# EAGLE design LED sign board 3 (EAGLE 7.2.0)
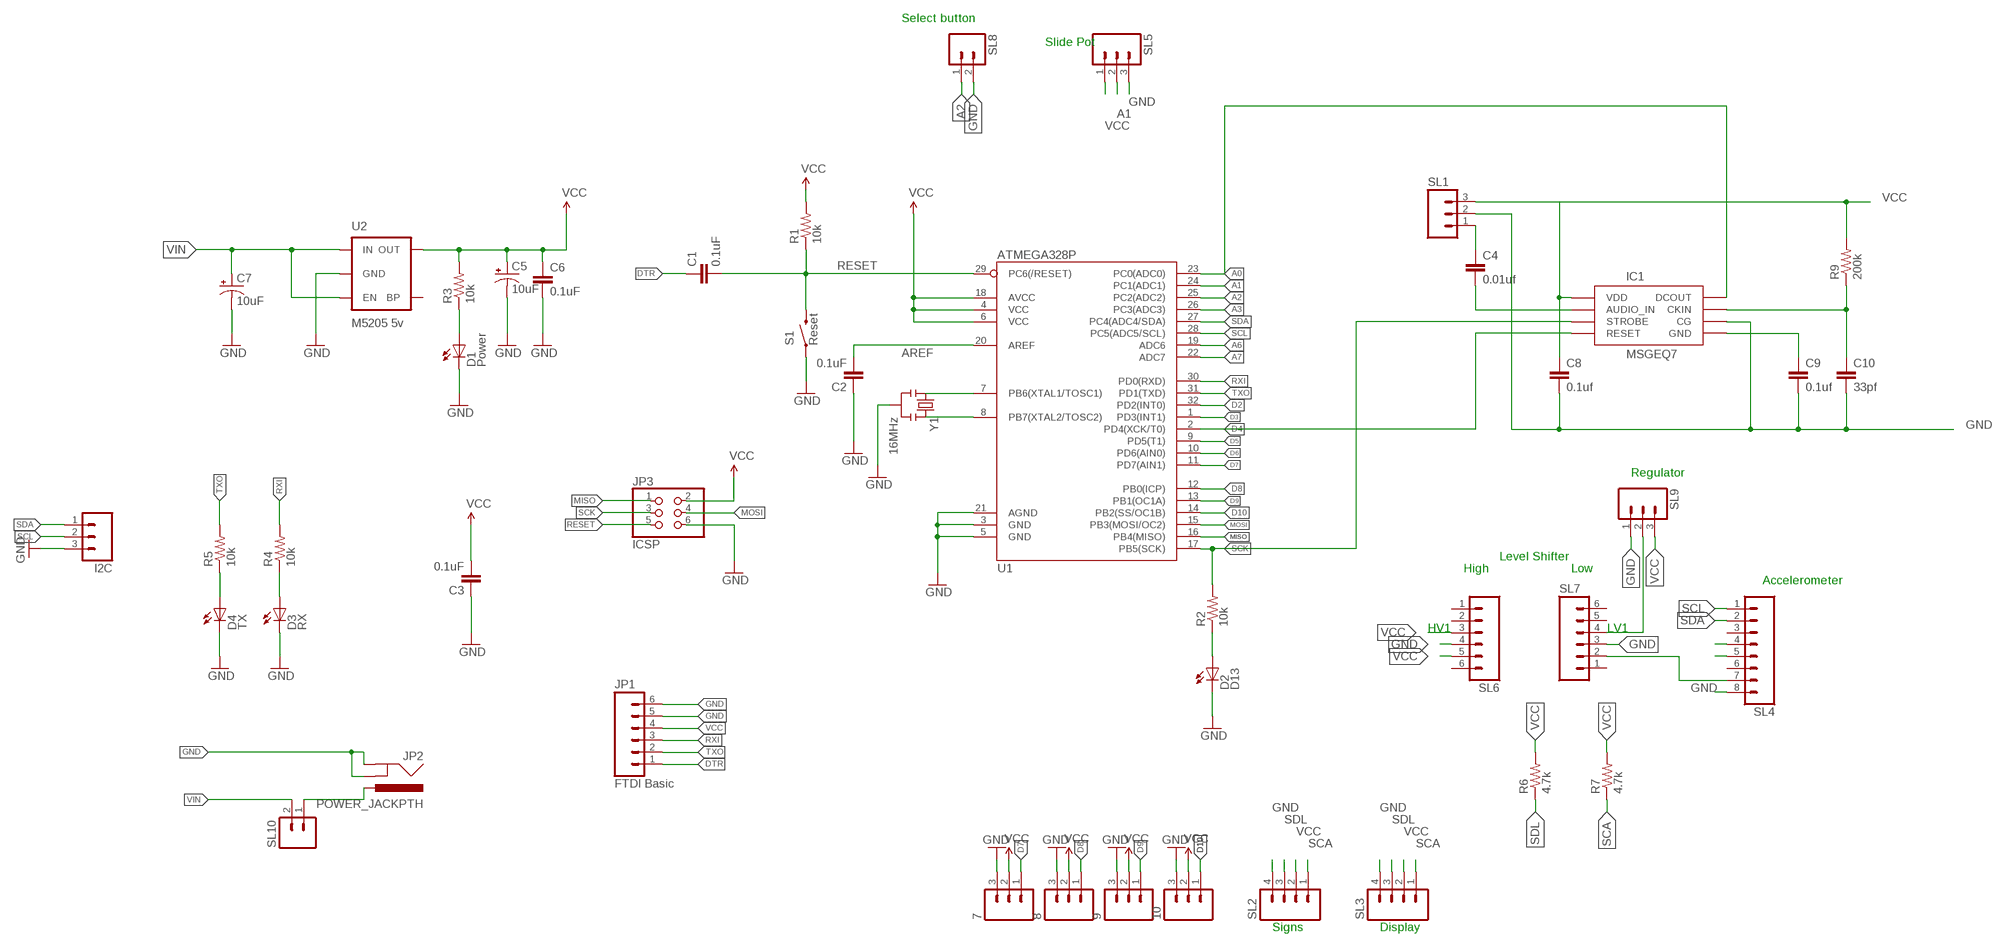
[diagram p0: schematic, sheet 1]

## Parts
7  M03PTH  [1X03]
8  M03PTH  [1X03]
9  M03PTH  [1X03]
10  M03PTH  [1X03]
C1  0.1uF  CAP0603-CAP  [0603-CAP]
C2  0.1uF  CAP0603-CAP  [0603-CAP]
C3  0.1uF  CAP0603-CAP  [0603-CAP]
C4  0.01uf  C2,5-3  [C2.5-3]
C5  10uF  CAP_POL1206  [EIA3216]
C6  0.1uF  CAP0603-CAP  [0603-CAP]
C7  10uF  CAP_POL1206  [EIA3216]
C8  0.1uf  C2,5-3  [C2.5-3]
C9  0.1uf  C2,5-3  [C2.5-3]
C10  33pf  C2,5-3  [C2.5-3]
D1  Power  LED-RED0603  [LED-0603]
D2  D13  LED-RED0603  [LED-0603]
D3  RX  LED-GREEN0603  [LED-0603]
D4  TX  LED-RED0603  [LED-0603]
I2C  M03PTH  [1X03]
IC1  MSGEQ7DIL  [DIL-08]
JP1  FTDI Basic  M06SIP  [1X06]
JP2  POWER_JACKPTH  [POWER_JACK_PTH]
JP3  ICSP  PINHD-2X3  [2X03]
R1  10k  RESISTOR0603-RES  [0603-RES]
R2  10k  RESISTOR0603-RES  [0603-RES]
R3  10k  RESISTOR0603-RES  [0603-RES]
R4  10k  RESISTOR0603-RES  [0603-RES]
R5  10k  RESISTOR0603-RES  [0603-RES]
R6  4.7k  RESISTOR1206  [1206]
R7  4.7k  RESISTOR1206  [1206]
R9  200k  RESISTOR1206  [1206]
S1  Reset  SWITCH-MOMENTARY-2SMD  [TACTILE_SWITCH_SMD]
SL1  M03  [03P]
SL2  M04  [04P]
SL3  M04  [04P]
SL4  M08  [08P]
SL5  M03  [03P]
SL6  M06  [06P]
SL7  M06  [06P]
SL8  M02  [02P]
SL9  M03  [03P]
SL10  M02  [02P]
U1  ATMEGA328P  ATMEGA328_SMT  [TQFP32-08]
U2  M5205 5v  MIC52055V  [SOT23-5]
Y1  16MHz  RESONATOR16MHZ  [RESONATOR-SMD]

## Nets
A0: IC1.3(DCOUT) U1.23(PC0(ADC0))
A1: SL5.2 U1.24(PC1(ADC1))
A2: SL8.1 U1.25(PC2(ADC2))
A3: U1.26(PC3(ADC3))
A6: U1.19(ADC6)
A7: U1.22(ADC7)
AREF: C2.2 U1.20(AREF)
D2: U1.32(PD2(INT0))
D3: U1.1(PD3(INT1))
D4: IC1.7(RESET) U1.2(PD4(XCK/T0))
D5: U1.9(PD5(T1))
D6: U1.10(PD6(AIN0))
D7: 7.1 U1.11(PD7(AIN1))
D8: 8.1 U1.12(PB0(ICP))
D9: 9.1 U1.13(PB1(OC1A))
D10: 10.1 U1.14(PB2(SS/OC1B))
DTR: C1.1 JP1.1
GND: 7.3 8.3 9.3 10.3 C2.1 C3.1 C5.C(-) C6.2 C7.C(-) C8.2 C9.2 C10.2 D1.C D2.C D3.C D4.C I2C.3 IC1.6(CG) JP1.5 JP1.6 JP2.GND JP2.GNDBREAK JP3.6 S1.1 SL1.2 SL2.4 SL3.4 SL4.8 SL5.3 SL6.4 SL7.3 SL7.4 SL8.2 SL9.1 SL9.2 U1.3(GND) U1.5(GND) U1.21(AGND) U2.2(GND) Y1.2
MISO: JP3.1 U1.16(PB4(MISO))
MOSI: JP3.4 U1.15(PB3(MOSI/OC2))
N$1: U1.7(PB6(XTAL1/TOSC1)) Y1.1
N$2: U1.8(PB7(XTAL2/TOSC2)) Y1.3
N$3: D1.A R3.1
N$4: D2.A R2.1
N$5: D3.A R4.1
N$6: D4.A R5.1
N$7: SL4.7 SL7.2
N$8: JP2.PWR SL10.1
N$9: C4.1 SL1.1
N$10: C4.2 IC1.5(AUDIO_IN)
N$11: C9.1 IC1.2(GND)
N$12: C10.1 IC1.8(CKIN) R9.1
N$14: SL4.5
N$15: SL4.4
RESET: C1.2 JP3.5 R1.1 S1.3 U1.29(PC6(/RESET))
RXI: JP1.3 R4.2 U1.30(PD0(RXD))
SCA: R7.1 SL2.1 SL3.1
SCK: IC1.4(STROBE) JP3.3 R2.2 U1.17(PB5(SCK))
SCL: I2C.2 SL4.1 U1.28(PC5(ADC5/SCL))
SDA: I2C.1 SL4.2 U1.27(PC4(ADC4/SDA))
SDL: R6.1 SL2.3 SL3.3
TXO: JP1.2 R5.2 U1.31(PD1(TXD))
VCC: 7.2 8.2 9.2 10.2 C3.2 C5.A(+) C6.1 C8.1 IC1.1(VDD) JP1.4 JP3.2 R1.2 R3.2 R6.2 R7.2 R9.2 SL1.3 SL2.2 SL3.2 SL5.1 SL6.3 SL6.5 SL9.3 U1.4(VCC) U1.6(VCC) U1.18(AVCC) U2.5(OUT)
VIN: C7.A(+) SL10.2 U2.1(IN) U2.3(EN)
Unconnected: SL4.3 SL4.6 SL6.1 SL6.2 SL6.6 SL7.1 SL7.5 SL7.6 U2.4(BP)

## Notes on the sheet
- Select button
- Slide Pot
- Regulator
- Level Shifter
- High | Low
- Accelerometer
- HV1 | LV1
- Signs | Display

## Library data of the parts
7-10 I2C = SparkFun-Connectors:M03: Header 3 Standard 3-pin 0.1" header. Use with straight break away headers (SKU : PRT-00116), right angle break away headers (PRT-00553), swiss pins (PRT-00743), machine pins (PRT-00117), and female headers (PRT-00115). Molex polarized connector foot print use with SKU : PRT-08232 with associated crimp pins and housings.
C1-C3 C6 = SparkFun-Passives:CAP: Capacitor Standard 0603 ceramic capacitor, and 0.1" leaded capacitor.
C4 C8-C10 = capacitor-wima:C: CAPACITOR naming: grid - package width
C5 C7 = SparkFun-Passives:CAP_POL: Capacitor Polarized These are standard SMD and PTH capacitors. Normally 10uF, 47uF, and 100uF in electrolytic and tantalum varieties. Always verify the external diameter of the through hole cap, it varies with capacity, voltage, and manufacturer. The EIA devices should be standard.
D1 D2 D4 = SparkFun-LED:LED-RED: Assorted Red LEDs LilyPad 1206- DIO-09912 1206- DIO-00809 0603- DIO-00819; PROD_ID: DIO-00819; VALUE: RED
D3 = SparkFun-LED:LED-GREEN: Various green LEDs Green LEDs used in SFE Production 0603- DIO-00821 LARGE- DIO-00862 LILYPAD- DIO-09910; PROD_ID: DIO-00821; VALUE: GREEN
IC1 = SparkFun-AnalogIC:MSGEQ7: 7-band graphic equalizer
JP1 = SparkFun-Connectors:M06: Header 6 Standard 6-pin 0.1" header. Use with straight break away headers (SKU : PRT-00116), right angle break away headers (PRT-00553), swiss pins (PRT-00743), machine pins (PRT-00117), and female headers (PRT-00115). Molex polarized connector foot print use with SKU : PRT-08094 with associated crimp pins and housings. NOTES ON THE VARIANTS LOCK and LOCK_LONGPADS... This footprint was designed to help hold the alignment of a through-hole component (i.e. 6-pin header) while soldering it into place. You may notice that each hole has been shifted either up or down by 0.005 of an inch from it's more standard position (which is a perfectly straight line). This slight alteration caused the pins (the squares in the middle) to touch the edges of the holes. Because they are alternating, it causes a "brace" to hold the component in place. 0.005 has proven to be the perfect amount of "off-center" position when using our standard breakaway headers. Although looks a little odd when you look at the bare footprint, once you have a header in there, the alteration is very hard to notice. Also,if you push a header all the way into place, it is covered up entirely on the bottom side. This idea of altering the position of holes to aid alignment will be further integrated into the Sparkfun Library for other footprints. It can help hold any component with 3 or more connection pins.
JP2 = SparkFun-Connectors:POWER_JACK: Power Jack This is the standard 5.5mm barrel jack for power. The PTH is the most common, proven, reliable, footprint. The Slot footprint only works if the mill layer is transmitted to the PCB fab house so be warned. Mating wall wart : TOL-00298 (and others); PROD_ID: CONN-08197
JP3 = SparkFun-Connectors:PINHD-2X3: PIN HEADER
R1-R5 = SparkFun-Passives:RESISTOR: Resistor Basic schematic elements and footprints for 0603, 1206, and PTH resistors.
R6 R7 R9 = SparkFun-Resistors:RESISTOR: Resistor Basic schematic elements and footprints for 0603, 1206, and PTH resistors.
S1 = SparkFun-Electromechanical:SWITCH-MOMENTARY-2: Various NO switches- pushbuttons, reed, etc; PROD_ID: SWCH-08247
SL1 SL5 SL9 = con-amp-quick:M03: AMP QUICK CONNECTOR; OC_FARNELL: unknown; OC_NEWARK: unknown
SL2 SL3 = con-amp-quick:M04: AMP QUICK CONNECTOR; OC_FARNELL: unknown; OC_NEWARK: unknown
SL4 = con-amp-quick:M08: AMP QUICK CONNECTOR; OC_FARNELL: unknown; OC_NEWARK: unknown
SL6 SL7 = con-amp-quick:M06: AMP QUICK CONNECTOR; OC_FARNELL: unknown; OC_NEWARK: unknown
SL8 SL10 = con-amp-quick:M02: AMP QUICK CONNECTOR; OC_FARNELL: unknown; OC_NEWARK: unknown
U1 = SparkFun-DigitalIC:ATMEGA328_SMT: 32-Pin Atmega328 part Commonly used on Arduino compatible boards Available in QFP and QFN packages TQFP is IC-09069 QFN is non-stock; PROD_ID: IC-09069
U2 = SparkFun-PowerIC:MIC5205: MIC5205 150mA vreg 3.3V - VREG-00822 5V - VREG-00823; PROD_ID: VREG-00823
Y1 = SparkFun-FreqCtrl:RESONATOR: Resonator Small SMD resonator. Used, eg, on the Arduino Pro/ Pro Mini boards. 8MHz- XTAL-08895 16MHz- XTAL-08900; PROD_ID: XTAL-08900

## Board
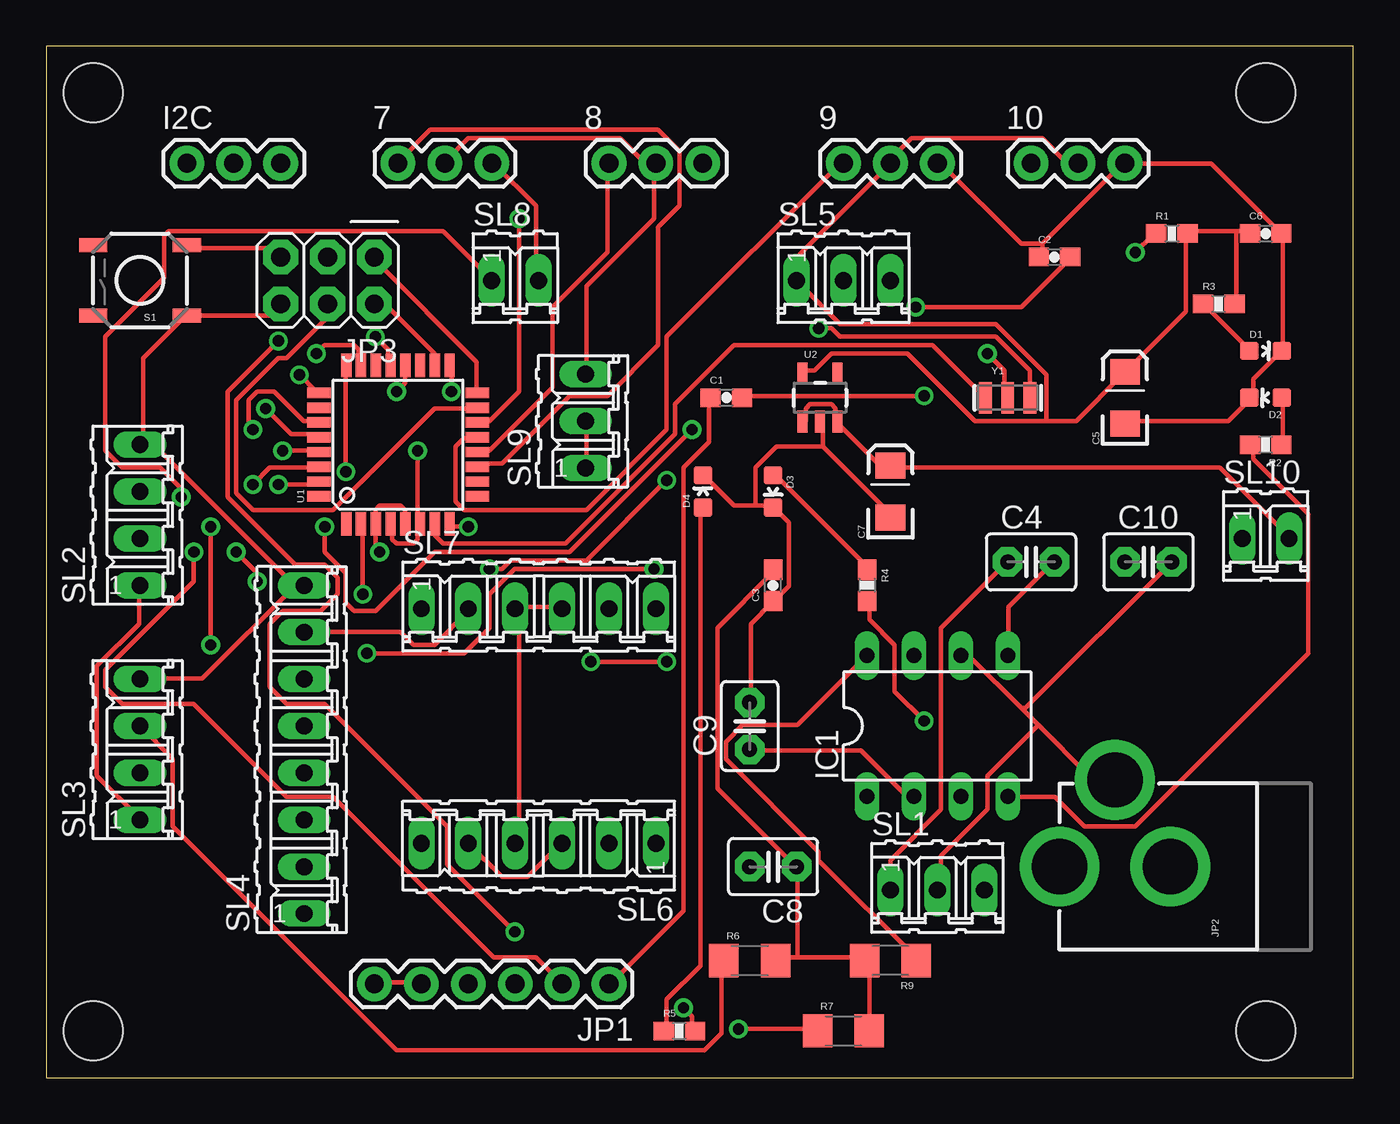
[diagram p1: board, top side]
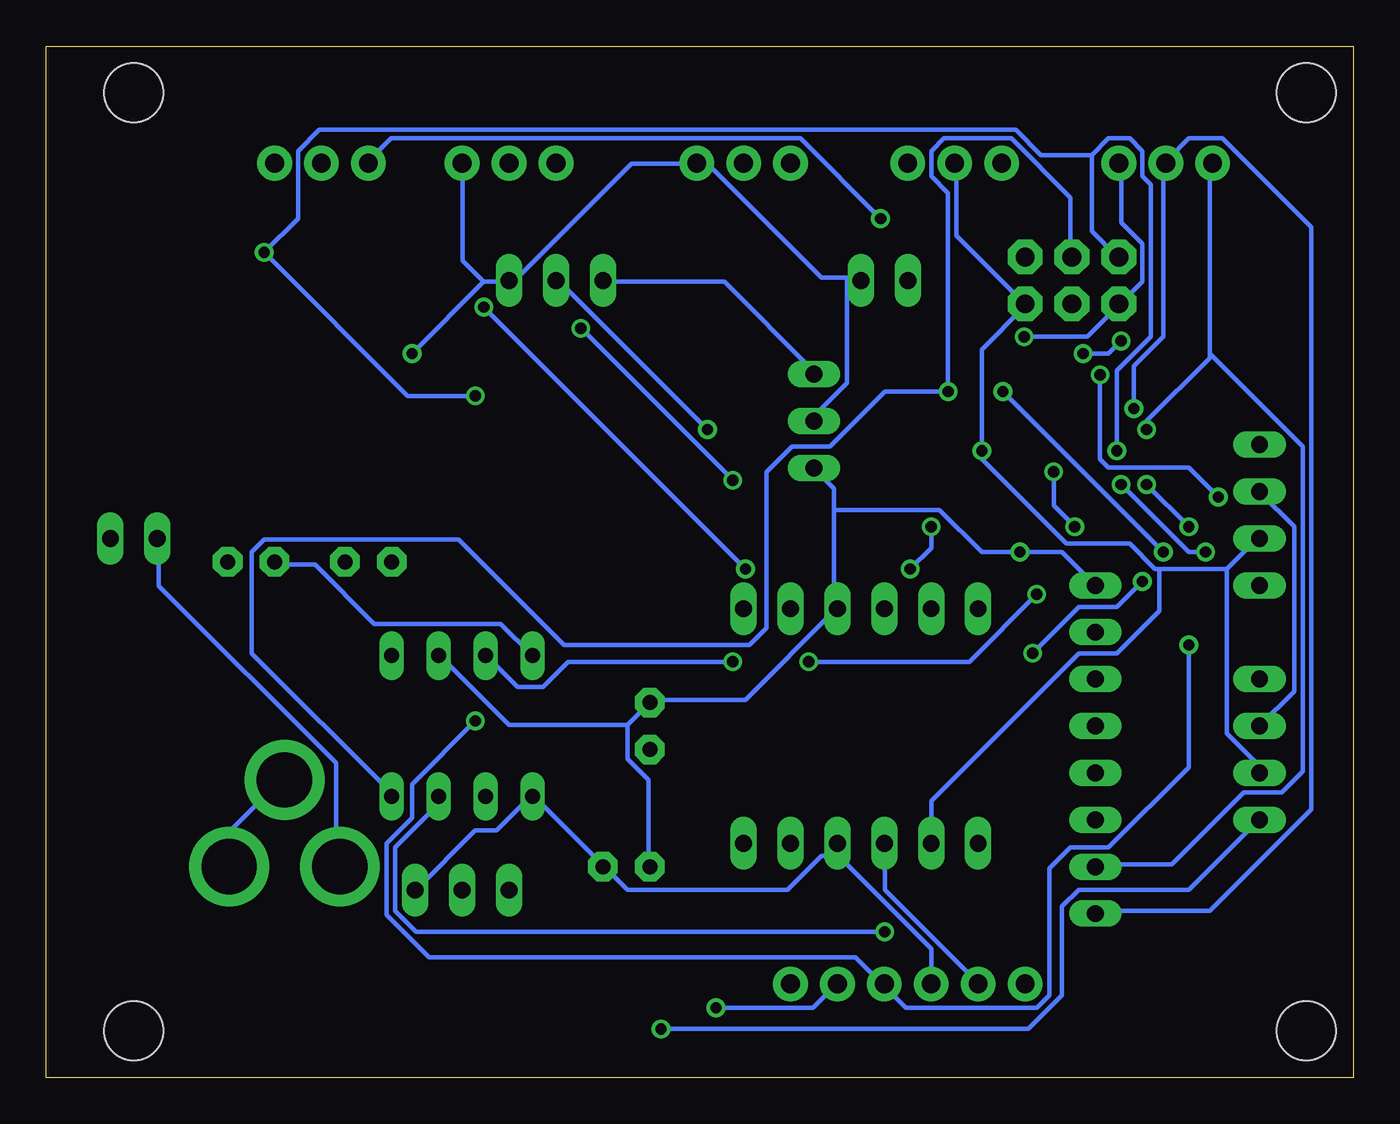
[diagram p2: board, bottom side, seen from below]

Size 70.79 x 55.87 mm. Coordinates in mm from the lower left corner, seen from the top.
Outline: 0,0 70.79,0 70.79,55.87 0,55.87 0,0
Copper layers (1*16): Top 0.035mm / dielectric 1.5mm / Bottom 0.035mm
Design rules "default": minimum track width 10mil, minimum drill 24mil, track to track 8mil, track to pad 8mil, pad to pad 8mil, via to via 8mil, smd to smd 8mil, copper to edge 40mil, drill to drill 8mil, minimum pad ring 10mil, minimum via ring 8mil, stop-mask expansion 4mil, vias tented up to drill 0mil, thermal gap 10mil
Holes 3.2 mm at 2.54,2.54 66.04,2.54 2.54,53.34 66.04,53.34

### Footprints (pad centres in the part's own frame; a part is rotated, then mirrored left to right if it is on the bottom)
1X03 = drill 1.016 pad 1.88: 1 0,0; 2 2.54,0; 3 5.08,0
0603-CAP = smd 1.1 x 1: 1 -0.85,0; 2 0.85,0
C2.5-3 = drill 0.813 pad 1.6 octagon: 1 -1.27,0; 2 1.27,0
EIA3216 = smd 1.4 x 1.6: A 1.4,0; C -1.4,0
LED-0603 = smd 1 x 1: A 0,-0.877; C 0,0.877
DIL-08 = drill 0.813 long: 1 -3.81,-3.81; 2 -1.27,-3.81; 3 1.27,-3.81; 4 3.81,-3.81; 5 3.81,3.81; 6 1.27,3.81; 7 -1.27,3.81; 8 -3.81,3.81
1X06 = drill 1.016 pad 1.88: 1 0,0; 2 2.54,0; 3 5.08,0; 4 7.62,0; 5 10.16,0; 6 12.7,0
POWER_JACK_PTH = drill 2.997 pad 4.318: GND 0,7.7; GNDBREAK 4.7,10.7; PWR 0,13.7
2X03 = drill 1.016 pad 1.88 octagon: 1 -2.54,-1.27; 2 -2.54,1.27; 3 0,-1.27; 4 0,1.27; 5 2.54,-1.27; 6 2.54,1.27
0603-RES = smd 1.1 x 1: 1 -0.85,0; 2 0.85,0
1206 = smd 1.6 x 1.8: 1 -1.4,0; 2 1.4,0
TACTILE_SWITCH_SMD = smd 1.524 x 0.762: 1 -2.54,1.905; 2 2.54,1.905; 3 -2.54,-1.905; 4 2.54,-1.905
03P = drill 0.914 long: 1 -2.54,0; 2 0,0; 3 2.54,0
04P = drill 0.914 long: 1 -3.81,0; 2 -1.27,0; 3 1.27,0; 4 3.81,0
08P = drill 0.914 long: 1 -8.89,0; 2 -6.35,0; 3 -3.81,0; 4 -1.27,0; 5 1.27,0; 6 3.81,0; 7 6.35,0; 8 8.89,0
06P = drill 0.914 long: 1 -6.35,0; 2 -3.81,0; 3 -1.27,0; 4 1.27,0; 5 3.81,0; 6 6.35,0
02P = drill 0.914 long: 1 -1.27,0; 2 1.27,0
TQFP32-08 = smd 1.27 x 0.559: 1 -4.293,2.8; 2 -4.293,2; 3 -4.293,1.2; 4 -4.293,0.4; 5 -4.293,-0.4; 6 -4.293,-1.2; 7 -4.293,-2; 8 -4.293,-2.8; 17 4.293,-2.8; 18 4.293,-2; 19 4.293,-1.2; 20 4.293,-0.4; 21 4.293,0.4; 22 4.293,1.2; 23 4.293,2; 24 4.293,2.8 | smd 0.559 x 1.27: 9 -2.8,-4.293; 10 -2,-4.293; 11 -1.2,-4.293; 12 -0.4,-4.293; 13 0.4,-4.293; 14 1.2,-4.293; 15 2,-4.293; 16 2.8,-4.293; 25 2.8,4.293; 26 2,4.293; 27 1.2,4.293; 28 0.4,4.293; 29 -0.4,4.293; 30 -1.2,4.293; 31 -2,4.293; 32 -2.8,4.293
SOT23-5 = smd 0.55 x 1.2: 1 -0.95,-1.3; 2 0,-1.3; 3 0.95,-1.3; 4 0.95,1.3; 5 -0.95,1.3
RESONATOR-SMD = smd 0.7 x 1.7: 1 -1.2,0; 2 0,0; 3 1.2,0

### Placement (x,y rotation side)
7  19.05,49.53 0 top
8  30.48,49.53 0 top
9  43.18,49.53 0 top
10  53.34,49.53 0 top
C1  36.83,36.83 0 top
C2  54.61,44.45 0 top
C3  39.37,26.67 90 top
C4  53.34,27.94 0 top
C5  58.42,36.83 90 top
C6  66.04,45.72 0 top
C7  45.72,31.75 90 top
C8  39.37,11.43 180 top
C9  38.1,19.05 90 top
C10  59.69,27.94 0 top
D1  66.04,39.37 270 top
D2  66.04,36.83 90 top
D3  39.37,31.75 180 top
D4  35.56,31.75 0 top
I2C  7.62,49.53 0 top
IC1  48.26,19.05 0 top
JP1  30.48,5.08 180 top
JP2  68.58,11.43 90 top
JP3  15.24,43.18 180 top
R1  60.96,45.72 0 top
R2  66.04,34.29 180 top
R3  63.5,41.91 0 top
R4  44.45,26.67 270 top
R5  34.29,2.54 0 top
R6  38.1,6.35 0 top
R7  43.18,2.54 0 top
R9  45.72,6.35 180 top
S1  5.08,43.18 180 top
SL1  48.26,10.16 0 top
SL2  5.08,30.48 90 top
SL3  5.08,17.78 90 top
SL4  13.97,17.78 90 top
SL5  43.18,43.18 0 top
SL6  26.67,12.7 180 top
SL7  26.67,25.4 0 top
SL8  25.4,43.18 0 top
SL9  29.21,35.56 90 top
SL10  66.04,29.21 0 top
U1  19.05,34.29 90 top
U2  41.91,36.83 0 top
Y1  52.07,36.83 0 top

### Tracks (layer width: path | path; a pad name or v marks a point on that pad's centre or on a via)
A0  (via drill 0.61)
  Top 0.254: v14.63,39.22 15.09,39.68 16.69,39.68 16.92,39.45 16.92,38.76 U1.23 | v12.57,39.9 9.83,37.16 9.83,31.45 13.49,27.79 15.09,27.79 15.77,27.1 15.77,26.19 14.86,25.27 12.8,25.27 12.12,24.59 12.12,21.16 13.03,20.24 15.09,20.24 21.72,13.61 21.72,11.56 v25.38,7.9
  Bottom 0.254: v14.63,39.22 13.26,39.22 v12.57,39.9 | v25.38,7.9 50.75,7.9 51.89,9.04 51.89,12.47 49.61,14.76 49.61,15.21 IC1.3
A1  (via drill 0.61)
  Top 0.254: v16.23,32.82 16.23,38.53 U1.24 | v15.09,29.84 15.09,28.47 16.23,27.33 16.23,25.73 16.69,25.27 17.83,25.27 21.03,28.47 28.35,28.47 v34.98,35.1
  Bottom 0.254: v16.23,32.82 16.23,30.99 v15.09,29.84 | v34.98,35.1 42.98,43.1 SL5.2
A2  (via drill 0.61)
  Top 0.254: v13.72,38.08 14.63,37.16 U1.25 | v7.32,31.45 7.32,31.9 6.17,33.05 4.12,33.05 3.2,33.96 3.2,40.13 6.4,43.33 6.4,45.62 6.63,45.85 21.49,45.85 24,43.33 SL8.1
  Bottom 0.254: v13.72,38.08 13.72,33.5 13.26,33.05 8.91,33.05 v7.32,31.45
AREF  (via drill 0.61)
  Top 0.254: v47.09,41.73 52.81,41.73 55.32,44.25 C2.2 | v32.92,27.56 25.38,27.56 24,26.19 24,24.36 22.63,22.99 v17.37,22.99 | v11.43,26.87 11.43,27.33 v10.29,28.47 | v18.97,37.16 19.43,37.62 19.43,38.53 U1.20
  Bottom 0.254: v32.92,27.56 v47.09,41.73 | v17.37,22.99 14.86,25.5 12.8,25.5 v11.43,26.87 | v18.97,37.16 v10.29,28.47
D4  (via drill 0.61)
  Top 0.254: v17.14,26.19 17.14,29.84 U1.2 | v33.6,22.53 v29.49,22.53
  Bottom 0.254: v17.14,26.19 20.8,22.53 v29.49,22.53 | v33.6,22.53 42.52,22.53 43.89,21.16 45.26,21.16 46.86,22.76 IC1.7
D7
  Top 0.254: U1.11 23.55,33.27 24.69,33.27 28.35,36.93 30.4,36.93 33.15,39.68 33.15,46.08 34.29,47.22 34.29,50.19 33.15,51.33 20.8,51.33 19.2,49.73 7.1
D8
  Top 0.254: U1.12 23.55,33.96 24,33.96 27.43,37.39 27.43,41.73 30.4,44.7 30.4,49.51 8.1
D9
  Top 0.254: U1.13 23.32,34.65 22.63,34.65 22.17,34.19 22.17,31.22 22.63,30.76 29.26,30.76 33.6,35.1 33.6,40.13 42.98,49.51 9.1
D10  (via drill 0.61)
  Top 0.254: v25.6,46.53 25.6,37.16 24,35.56 23.55,35.56 U1.14
  Bottom 0.254: v25.6,46.53 29.95,50.88 52.12,50.88 53.26,49.73 10.1
DTR
  Top 0.254: C1.1 35.89,36.7 35.89,34.42 34.52,33.05 34.52,9.04 30.63,5.16 JP1.1
GND  (via drill 0.61)
  Top 0.254: 42.06,34.19 42.06,35.33 U2.2 | 42.06,34.19 45.72,30.53 C7.C | 38.41,30.99 37.26,30.99 35.66,32.59 D4.C | 38.41,30.99 39.32,30.99 D3.C 39.55,30.76 40.23,30.07 40.23,26.64 39.55,25.96 C3.1 39.32,25.73 38.18,24.59 38.18,20.47 C9.2 | 42.06,34.19 39.55,34.19 38.41,33.05 38.41,30.99 | 53.72,19.1 56.46,16.36 57.84,16.36 JP2.GNDBREAK | 53.72,19.1 52.81,20.02 | 52.81,20.02 50.06,22.76 49.61,22.76 IC1.6 | 53.72,19.1 50.98,16.36 50.98,14.53 48.46,12.01 48.46,10.18 SL1.2 | C10.2 53.03,20.02 52.81,20.02 | C5.C 58.52,35.56 64.01,35.56 65.15,36.7 D2.C 65.38,36.93 65.38,37.85 66.75,39.22 D1.C 66.98,39.45 66.98,45.62 C6.2 66.75,45.85 63.09,49.51 58.52,49.51 10.3 58.29,49.51 53.95,45.16 | 53.95,45.16 53.95,44.48 C2.1 | v50.98,39.22 51.89,38.3 51.89,36.93 Y1.2 | 53.95,45.16 52.81,45.16 48.46,49.51 9.3 | v17.83,40.13 18.52,39.45 18.52,38.76 U1.21 | JP3.6 12.57,41.73 12.12,41.28 S1.1 7.54,41.28 5.26,38.99 5.26,34.42 SL2.4 5.26,34.19 5.94,34.19 13.49,26.64 | U1.5 19.43,30.07 19.43,30.76 19.2,30.99 18.06,30.99 17.83,30.76 17.83,30.07 U1.3 17.83,29.84 17.83,28.7 v18.06,28.47 | 13.49,26.64 8.46,21.61 5.26,21.61 SL3.4 | 13.49,26.64 13.95,26.64 SL4.8 13.49,26.64 | JP1.6 17.83,5.16 20.12,5.16 JP1.5 | SL7.4 27.89,25.5 25.6,25.5 SL7.3 25.6,25.27 25.6,12.7 SL6.4 | SL9.1 29.26,33.05 29.26,35.56 SL9.2 | SL8.2 26.52,43.33 26.52,47.22 24.23,49.51 7.3
  Bottom 0.254: 39.32,19.1 39.32,17.27 38.18,16.13 38.18,11.56 C8.2 | 39.32,19.1 C9.2 37.95,20.47 32.92,20.47 28.12,25.27 SL7.4 28.12,25.5 28.12,30.76 | JP2.GND 60.81,11.56 60.81,13.39 58.06,16.13 JP2.GNDBREAK | 39.32,19.1 45.72,19.1 49.38,22.76 IC1.6 | 47.09,43.1 v50.98,39.22 | 47.09,43.1 45.72,43.1 SL5.3 45.72,43.33 45.26,43.33 39.09,49.51 35.66,49.51 8.3 35.43,49.51 34.98,49.51 28.8,43.33 27.43,43.33 | 47.09,43.1 48.23,44.25 48.23,49.51 9.3 | v17.83,40.13 14.4,40.13 12.8,41.73 JP3.6 12.57,41.96 11.43,43.1 11.43,45.16 12.57,46.3 12.57,49.51 I2C.3 | SL4.8 15.77,28.47 v18.06,28.47 20.12,28.47 22.4,30.76 28.12,30.76 | SL6.4 25.38,12.7 25.38,10.18 20.34,5.16 JP1.5 | 28.12,30.76 28.12,31.9 29.03,32.82 SL9.1 | 27.43,43.33 26.75,43.33 SL8.2 | 27.43,43.33 27.43,37.62 29.03,36.02 29.03,35.56 SL9.2
MISO
  Top 0.254: U1.16 23.32,37.16 23.32,38.76 17.83,44.25 JP3.1
MOSI
  Top 0.254: U1.15 23.32,36.25 21.03,36.25 15.54,30.76 11.2,30.76 10.29,31.67 10.29,36.7 12.57,38.99 13.03,38.99 15.09,41.05 15.09,41.73 JP3.4
N$1
  Top 0.254: U1.7 21.03,29.84 21.03,29.39 21.49,28.93 28.12,28.93 34.06,34.87 34.06,36.47 37.26,39.68 48.01,39.68 50.75,36.93 Y1.1
N$2  (via drill 0.61)
  Top 0.254: v22.86,29.84 21.95,29.84 U1.8 | v24,27.56 24.69,27.56 25.15,28.02 29.26,28.02 v33.6,32.36 | v41.83,40.59 42.52,40.59 42.98,40.13 51.44,40.13 53.26,38.3 53.26,36.93 Y1.3
  Bottom 0.254: v22.86,29.84 22.86,28.7 v24,27.56 | v41.83,40.59 v33.6,32.36
N$3
  Top 0.254: D1.A 65.15,39.45 62.87,41.73 R3.1
N$4
  Top 0.254: D2.A 66.98,36.7 66.98,34.42 R2.1
N$5
  Top 0.254: D3.A 39.55,32.59 44.58,27.56 R4.1
N$6
  Top 0.254: D4.A 35.43,30.76 35.43,6.07 33.6,4.24 33.6,2.64 R5.1
N$7
  Top 0.254: SL4.7 19.2,24.13 19.89,23.44 21.03,23.44 22.86,25.27 SL7.2
N$8
  Bottom 0.254: SL10.1 64.69,29.16 64.69,26.64 55.09,17.04 55.09,11.56 JP2.PWR
N$9
  Top 0.254: SL1.1 45.72,11.79 48.46,14.53 48.46,24.36 51.89,27.79 C4.1
N$10
  Top 0.254: IC1.5 52.12,22.99 52.12,25.5 54.41,27.79 C4.2
N$11
  Top 0.254: IC1.2 46.86,15.44 46.41,15.44 44.12,17.73 38.18,17.73 C9.1
N$12
  Top 0.254: IC1.8 40.69,19.1 37.72,19.1 36.8,18.19 36.8,17.27 41.83,12.24 41.83,11.79 47.09,6.53 R9.1
  Bottom 0.254: IC1.8 46.18,24.59 53.03,24.59 56.24,27.79 58.29,27.79 C10.1
RESET  (via drill 0.61)
  Top 0.254: v12.8,33.96 14.63,33.96 U1.29 | S1.3 7.77,44.93 12.12,44.93 12.57,44.48 JP3.5 | v47.55,36.93 37.72,36.93 C1.2 | v58.98,44.7 59.89,45.62 R1.1
  Bottom 0.254: v12.8,33.96 12.8,38.3 10.97,40.13 10.97,48.36 11.43,48.82 11.43,50.19 12.12,50.88 13.26,50.88 14.17,49.96 | 14.17,49.96 14.17,45.85 12.8,44.48 JP3.5 | v47.55,36.93 51.21,36.93 v58.98,44.7 57.15,46.53 57.15,50.19 56.01,51.33 18.29,51.33 16.92,49.96 14.17,49.96
RXI  (via drill 0.61)
  Top 0.254: v47.55,19.33 45.95,20.93 45.95,23.44 44.58,24.82 44.58,25.73 R4.2 | v11.2,32.13 12.12,33.05 14.63,33.05 U1.30 | v8.91,23.44 v8.91,29.84
  Bottom 0.254: v47.55,19.33 50.98,15.9 50.98,14.07 52.35,12.7 52.35,8.81 50.06,6.53 26.98,6.53 25.6,5.16 JP1.3 25.38,4.93 24.23,3.79 17.14,3.79 16.46,4.47 16.46,11.33 15.32,12.47 13.26,12.47 8.91,16.82 v8.91,23.44 | v8.91,29.84 v11.2,32.13
SCA  (via drill 0.61)
  Top 0.254: v37.49,2.64 41.6,2.64 R7.1 | SL2.1 5.03,26.64 5.03,24.59 2.74,22.3 2.74,16.36 5.03,14.07 SL3.1
  Bottom 0.254: v37.49,2.64 17.6,2.64 15.77,4.47 15.77,9.27 14.86,10.18 8.91,10.18 5.26,13.84 SL3.1
SCK  (via drill 0.61)
  Top 0.254: v21.95,37.16 21.95,38.53 U1.17 | R2.2 65.38,34.19 65.38,33.5 68.35,30.53 68.35,22.99 58.98,13.61 56.24,13.61 54.63,15.21 52.12,15.21 IC1.4
  Bottom 0.254: JP3.3 15.32,44.48 15.32,47.68 18.52,50.88 22.17,50.88 22.86,50.19 22.86,48.82 21.95,47.9 v21.95,37.16 25.38,37.16 28.35,34.19 30.4,34.19 31.77,32.82 31.77,24.36 32.69,23.44 42.75,23.44 48.46,29.16 58.98,29.16 59.66,28.47 59.66,22.99 52.12,15.44 IC1.4
SCL  (via drill 0.61)
  Top 0.254: v11.89,36.25 13.26,34.87 14.63,34.87 U1.28
  Bottom 0.254: v11.89,36.25 11.89,38.53 10.29,40.13 10.29,49.51 I2C.2 10.06,49.73 8.91,50.88 7.09,50.88 2.29,46.08 2.29,14.53 7.77,9.04 13.95,9.04 SL4.1
SDA  (via drill 0.61)
  Top 0.254: v11.2,35.1 10.97,35.33 10.97,36.7 11.43,37.16 12.34,37.16 13.95,35.56 14.63,35.56 U1.27
  Bottom 0.254: v11.2,35.1 11.2,35.56 7.77,38.99 7.77,39.22 | 7.77,39.22 7.77,49.51 I2C.1 | 7.77,39.22 2.74,34.19 2.74,16.59 3.89,15.44 5.94,15.44 9.83,11.56 13.95,11.56 SL4.2
SDL
  Top 0.254: SL3.3 6.86,17.27 6.86,13.61 18.97,1.5 35.66,1.5 36.58,2.41 36.58,6.3 R6.1
  Bottom 0.254: SL3.3 3.2,20.93 3.2,29.84 5.03,31.67 SL2.3
TXO  (via drill 0.61)
  Top 0.254: v34.52,3.79 34.98,3.33 34.98,2.64 R5.2 | v12.57,32.13 14.63,32.13 U1.31 | v8,28.47 8,26.87 3.2,22.07 3.2,21.16 4.12,20.24 8,20.24 13.03,15.21 15.54,15.21 24.23,6.53 26.52,6.53 27.89,5.16 JP1.2
  Bottom 0.254: v34.52,3.79 29.26,3.79 28.12,4.93 JP1.2 | v12.57,32.13 8.91,28.47 v8,28.47
VCC  (via drill 0.61)
  Top 0.254: SL6.5 24.69,10.87 26.06,10.87 27.89,12.7 SL6.3 | 40.69,6.53 44.12,6.53 R9.2 44.35,6.3 44.58,6.07 44.58,2.64 R7.2 | 40.69,6.53 39.55,6.53 R6.2 | C3.2 39.32,27.33 36.35,24.36 36.35,15.67 40.46,11.56 C8.1 40.69,11.33 40.69,6.53 | 64.47,45.85 65.15,45.85 C6.1 | 64.47,45.85 61.95,45.85 R1.2 61.72,45.62 61.72,41.5 58.52,38.3 C5.A 58.29,38.08 55.78,35.56 54.18,35.56 | 64.47,45.85 64.47,41.96 R3.2 | 54.18,35.56 50.29,35.56 46.63,39.22 42.52,39.22 41.6,38.3 41.15,38.3 U2.5 | 10.2 55.78,49.73 55.09,49.73 53.95,50.88 46.86,50.88 45.72,49.73 9.2 45.72,49.51 40.69,44.48 40.69,43.33 SL5.1 40.69,43.1 42.98,40.82 51.44,40.82 54.18,38.08 54.18,35.56 | SL9.3 29.26,38.3 29.26,42.88 32.92,46.53 32.92,49.51 8.2 32.92,49.73 32.23,49.73 31.09,50.88 22.86,50.88 21.72,49.73 7.2 | U1.4 18.75,29.84 18.75,29.16 18.97,28.93 19.89,28.93 20.12,29.16 20.12,29.84 U1.6 20.12,30.07 v20.12,33.96 | U1.18 21.03,38.76 21.03,39.22 18.52,41.73 17.83,41.73 JP3.2
  Bottom 0.254: JP1.4 22.86,6.98 27.89,12.01 | 27.89,12.01 27.89,12.7 SL6.3 27.89,12.01 | SL1.3 50.75,10.18 47.55,13.39 46.41,13.39 44.58,15.21 IC1.1 44.35,15.21 40.69,11.56 C8.1 40.46,11.33 39.32,10.18 30.63,10.18 28.8,12.01 27.89,12.01 | 6.86,27.56 6.86,18.64 5.26,17.04 5.26,16.59 SL3.2 | 6.86,27.56 5.26,29.16 SL2.2 | 7.2 21.49,49.51 21.49,45.62 JP3.2 17.83,41.73 20.12,39.45 v20.12,33.96 20.12,33.5 15.54,28.93 12.12,28.93 10.74,27.56 10.52,27.56 | 10.52,27.56 6.86,27.56 | SL5.1 40.46,43.1 34.06,43.1 29.26,38.3 SL9.3 | SL6.5 22.86,14.99 14.86,22.99 12.8,22.99 10.52,25.27 10.52,27.56
VIN
  Top 0.254: U2.1 41.15,35.56 41.15,36.25 41.38,36.47 42.52,36.47 42.75,36.25 42.75,35.56 U2.3 42.98,35.33 45.03,33.27 45.72,33.27 C7.A 45.72,33.05 63.55,33.05 67.21,29.39 SL10.2